# Altium schematic sheet Block Diagram.SchDoc: Block Diagram
size A; Author: Alfredo Cortellini; Organization: IT Logic; Address1: 5753 Highway 85 N; Address2: Crestview, FL 32536; Address3: United States; DocumentNumber: 3; SheetNumber: 3; SheetTotal: 13; Email: pcb-design@itlogic.cloud
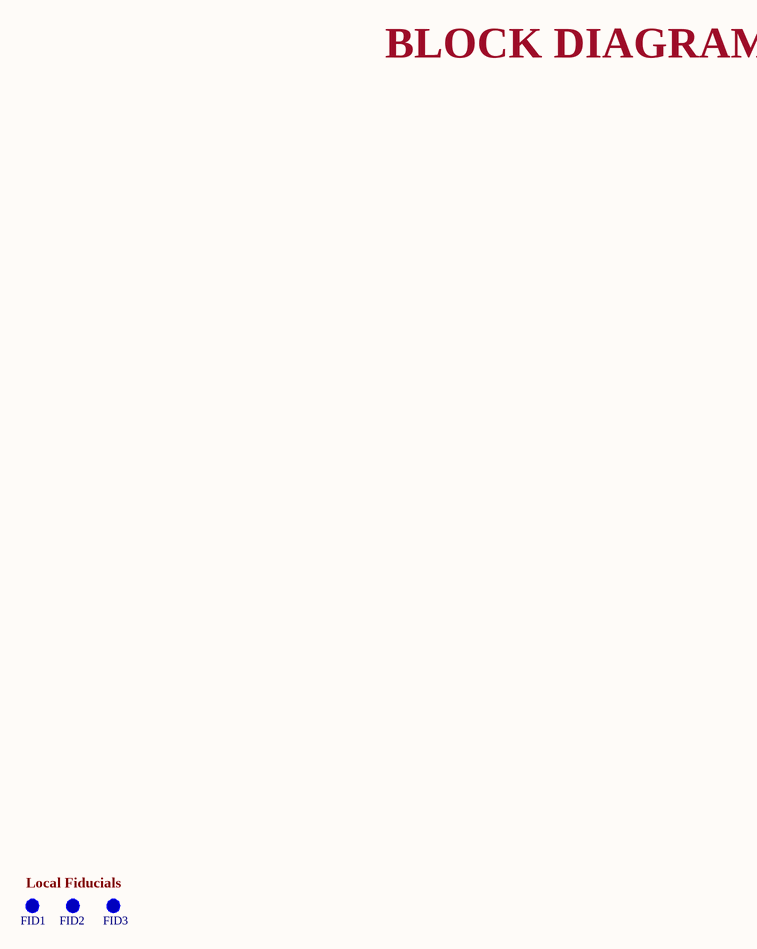
[diagram p0: Block Diagram.SchDoc]

## Parts
FID1  Local Fiducial  [FID-1-2MM]  (value not drawn)
FID2  Local Fiducial  [FID-1-2MM]  (value not drawn)
FID3  Local Fiducial  [FID-1-2MM]  (value not drawn)

## Notes on the sheet
- BLOCK DIAGRAM
- Local Fiducials
- Project:
- Revision:
- Title:
- Sheet:
- of
- Variant:
- IT Logic
- 5753 Highway 85 N
- Crestview, FL 32536
- United States
- Date:
- Author:
- Size:
- A
- Email: pcb-design@itlogic.cloud

## Library data of the parts
FID1-FID3 = FID-1-2MM: Fiducial 1.0mm Diameter, 2.0mmil Mask